# EAGLE design stromplatine (EAGLE 6.6.0)
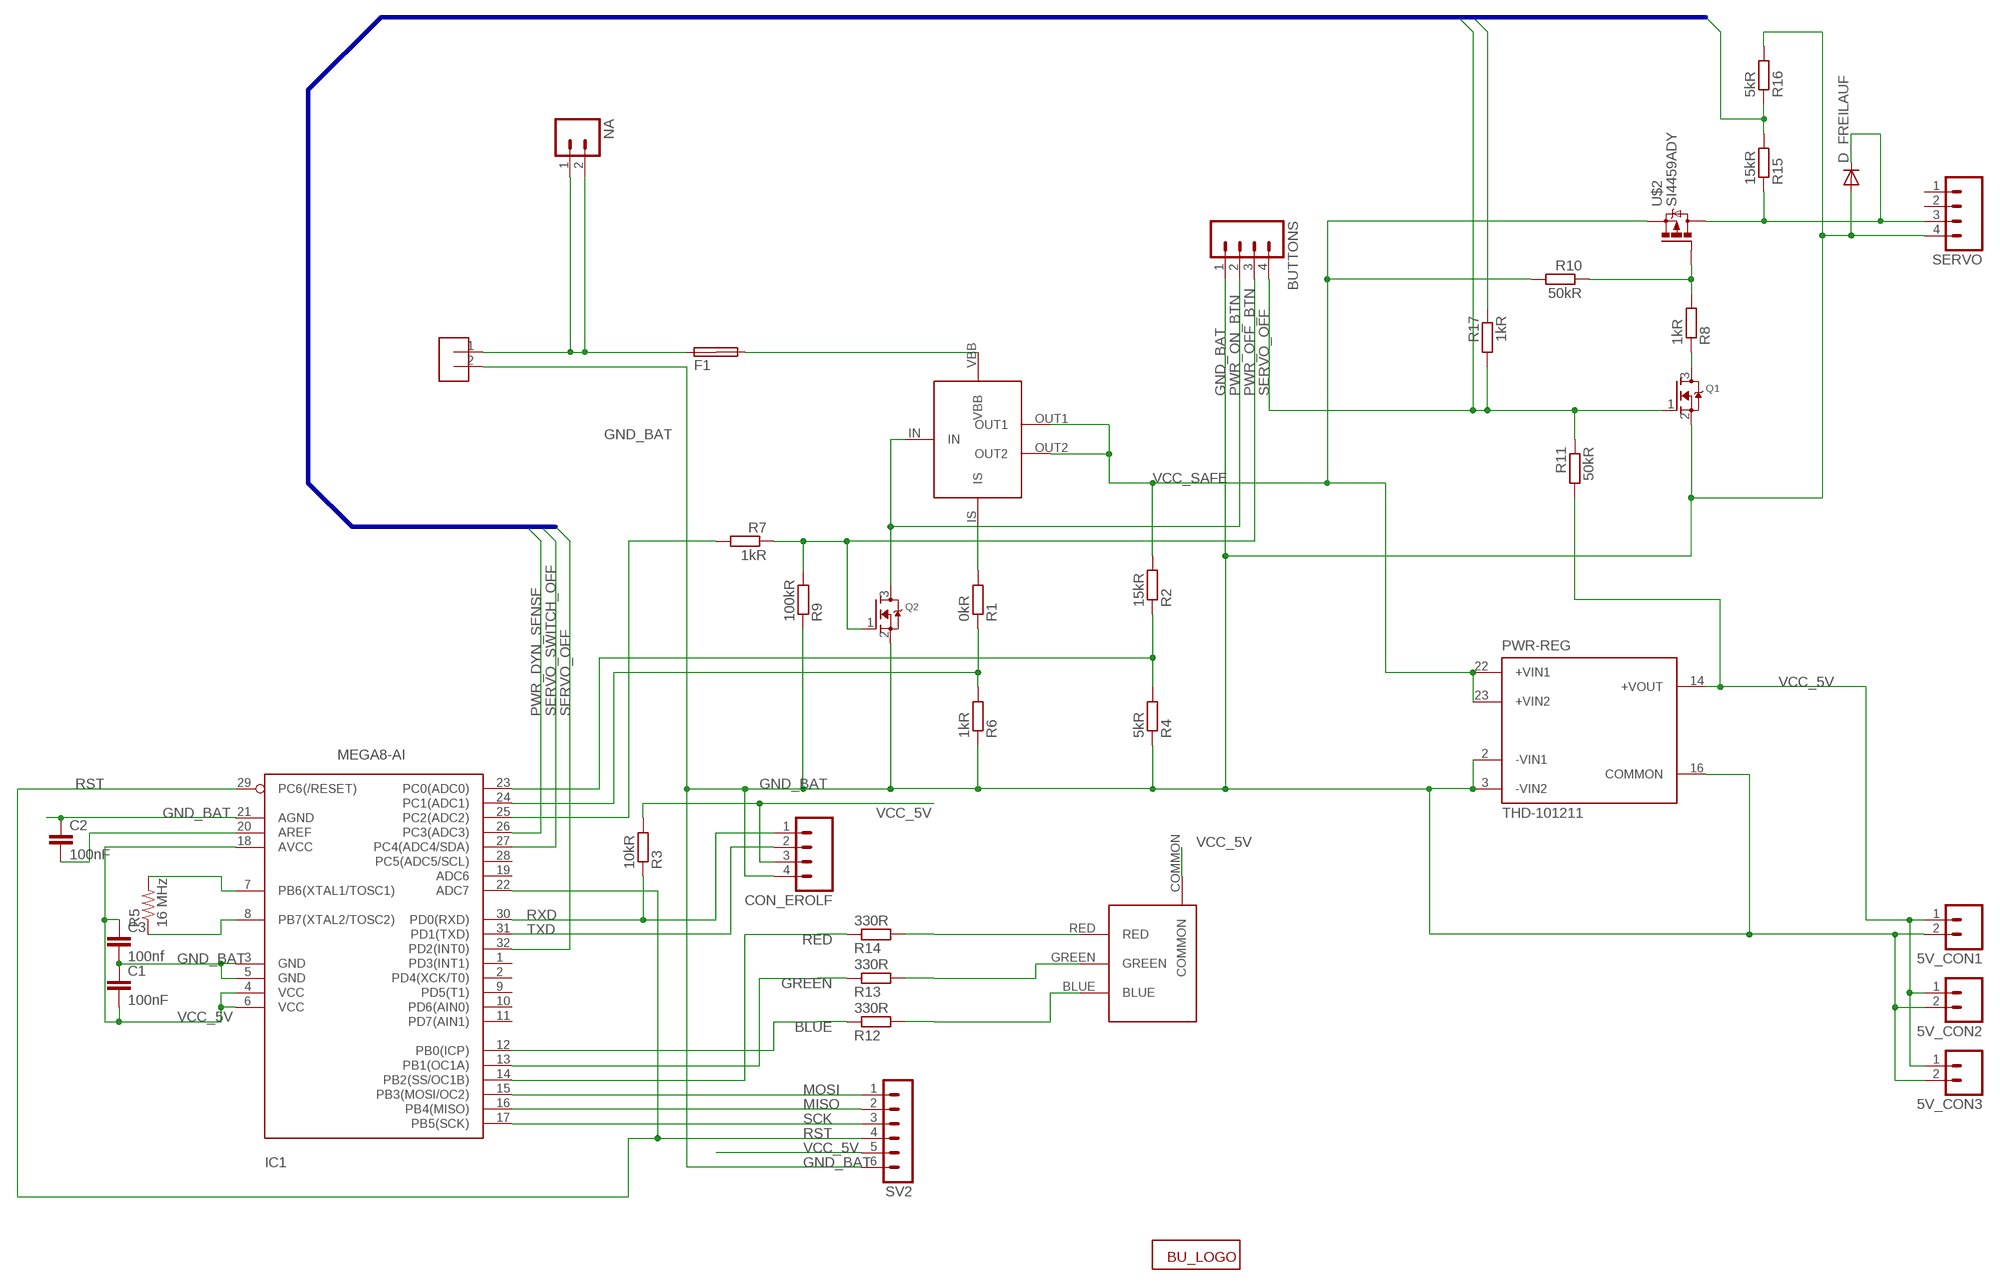
[diagram p0: schematic, sheet 1]

## Parts
5V_CON1  M02  [02P]
5V_CON2  M02  [02P]
5V_CON3  M02  [02P]
BUTTONS  M04  [04P]
C1  100nF  C-EUC0805  [C0805]
C2  100nF  C-EUC0805  [C0805]
C3  100nf  C-EUC0805  [C0805]
CON_BAT  STROMSTECKER  [STROMSTECKER]
CON_EROLF  M04  [04P]
D_FREILAUF  DIODE-DO-214AC  [DO-214AC]
F1  SHK20Q  [SHK20Q]
IC1  MEGA8-AI  [TQFP32-08]
NA  M02  [02P]
PWR-REG  THD-101211  TEN_30512  [TEN3XXXX]
Q1  MOSFET-NREFLOW  [SOT23]
Q2  MOSFET-NREFLOW  [SOT23]
R1  0kR  R-EU_M0805  [M0805]
R2  15kR  R-EU_M0805  [M0805]
R3  10kR  R-EU_M0805  [M0805]
R4  5kR  R-EU_M0805  [M0805]
R5  16 MHz  R-US_MELF0102W  [MINI_MELF-0102W]
R6  1kR  R-EU_M0805  [M0805]
R7  1kR  R-EU_M0805  [M0805]
R8  1kR  R-EU_M0805  [M0805]
R9  100kR  R-EU_M0805  [M0805]
R10  50kR  R-EU_M0805  [M0805]
R11  50kR  R-EU_M0805  [M0805]
R12  330R  R-EU_M0805  [M0805]
R13  330R  R-EU_M0805  [M0805]
R14  330R  R-EU_M0805  [M0805]
R15  15kR  R-EU_M0805  [M0805]
R16  5kR  R-EU_M0805  [M0805]
R17  1kR  R-EU_M0805  [M0805]
SERVO  M04  [04P]
SV2  MA06-1  [MA06-1]
U$1  BTS555  [PG-TO218]
U$2  SI4459ADY  [SO-8]
U$3  RGB-LED  [4-PLCC]
U$4  LOGO  [LOGO]

## Nets
BLUE: IC1.12(PB0(ICP)) R12.1
GND_BAT: 5V_CON1.2 5V_CON2.2 5V_CON3.2 BUTTONS.1 C1.1 C2.1 C3.2 CON_BAT.2 CON_EROLF.4 D_FREILAUF.A IC1.3(GND) IC1.5(GND) IC1.21(AGND) PWR-REG.2(-VIN1) PWR-REG.3(-VIN2) PWR-REG.16(COMMON) Q1.2(S) Q2.2(S) R4.1 R6.1 R9.1 R16.2 SERVO.4 SV2.6
GREEN: IC1.13(PB1(OC1A)) R13.1
MISO: IC1.16(PB4(MISO)) SV2.2
MOSI: IC1.15(PB3(MOSI/OC2)) SV2.1
N$2: F1.2A U$1.VBB
N$3: CON_BAT.1 F1.1A NA.1 NA.2
N$4: IC1.7(PB6(XTAL1/TOSC1)) R5.2
N$5: R12.2 U$3.BLUE
N$6: R13.2 U$3.GREEN
N$7: IC1.8(PB7(XTAL2/TOSC2)) R5.1
N$8: IC1.23(PC0(ADC0)) R2.1 R4.2
N$9: D_FREILAUF.C R15.1 SERVO.3 U$2.P5(D) U$2.P6(D) U$2.P7(D) U$2.P8(D)
N$10: C2.2 IC1.20(AREF)
N$11: R8.2 R10.1 U$2.P4(G)
N$12: IC1.24(PC1(ADC1)) R1.1 R6.2
N$13: R1.2 U$1.IS
N$14: Q1.3(D) R8.1
N$16: R14.2 U$3.RED
N$17: IC1.25(PC2(ADC2)) R7.2
PWR_DYN_SENSE: IC1.26(PC3(ADC3)) R15.2 R16.1
PWR_OFF_BTN: BUTTONS.3 Q2.1(G) R7.1 R9.2
PWR_ON_BTN: BUTTONS.2 Q2.3(D) U$1.IN
RED: IC1.14(PB2(SS/OC1B)) R14.1
RST: IC1.22(ADC7) IC1.29(PC6(/RESET)) SV2.4
RXD: CON_EROLF.1 IC1.30(PD0(RXD)) R3.1
SCK: IC1.17(PB5(SCK)) SV2.3
SERVO_OFF: BUTTONS.4 IC1.32(PD2(INT0)) Q1.1(G) R11.1 R17.2
SERVO_SWITCH_OFF: IC1.27(PC4(ADC4/SDA)) R17.1
TXD: CON_EROLF.2 IC1.31(PD1(TXD))
VCC_5V: 5V_CON1.1 5V_CON2.1 5V_CON3.1 C1.2 C3.1 CON_EROLF.3 IC1.4(VCC) IC1.6(VCC) IC1.18(AVCC) PWR-REG.14(+VOUT) R3.2 R11.2 SV2.5 U$3.COMMON
VCC_SAFE: PWR-REG.22(+VIN1) PWR-REG.23(+VIN2) R2.2 R10.2 U$1.OUT1 U$1.OUT2 U$2.P1(S) U$2.P2(S) U$2.P3(S)
Unconnected: F1.1B F1.2B IC1.1(PD3(INT1)) IC1.2(PD4(XCK/T0)) IC1.9(PD5(T1)) IC1.10(PD6(AIN0)) IC1.11(PD7(AIN1)) IC1.19(ADC6) IC1.28(PC5(ADC5/SCL)) SERVO.1 SERVO.2

## Buses
SERVO_SWITCH_OFF,SERVO_OFF,PWR_DYN_SWITCH_SENSR,PWR_DYN_SENSE

## Library data of the parts
5V_CON1-5V_CON3 NA = con-amp-quick:M02: AMP QUICK CONNECTOR; OC_FARNELL: unknown; OC_NEWARK: unknown
BUTTONS CON_EROLF SERVO = con-amp-quick:M04: AMP QUICK CONNECTOR; OC_FARNELL: unknown; OC_NEWARK: unknown
C1-C3 = resistor:C-EU: CAPACITOR, European symbol
CON_BAT = motorboard:STROMSTECKER
D_FREILAUF = diode:DIODE-: DIODE
F1 = fuse:SHK20Q: FUSE HOLDER 5 x 20 mm, SH contact, E1207 Buerklin 64G6061; OC_FARNELL: unknown; OC_NEWARK: unknown
IC1 = atmel:MEGA8: MICROCONTROLLER 8 Kbytes FLASH 1 kbytes SRAM 512 bytes EEPROM USART 6-channel 10 bit ADC 2-channel 8 bit ADC Source: avr.lbr
PWR-REG = traco-electronic:TEN_3*: DC/DC Konverter 3 Watt, 2 x Input, 1 x Output Source: http://www.tracopower.com/datasheet_g/ten3-d.pdf; OC_FARNELL: unknown; OC_NEWARK: unknown
Q1 Q2 = adafruit:MOSFET-N: N-Channel Mosfet 2N7002E - 60V 260mA SOT23 [Digikey: 2N7002ET1GOSTR-ND] - REEL BSH103 - 30V 850mA SOT23 [Digikey: 568-5013-1-ND]
R1-R4 R6-R17 = resistor:R-EU_: RESISTOR, European symbol
R5 = rcl:R-US_: RESISTOR, American symbol
SV2 = con-lstb:MA06-1: PIN HEADER
U$1 = bts555:BTS555
U$2 = vishay:SI4459ADY: P-Channel-MOSFET 29A 30V SO-8 http://www.digikey.com/product-detail/en/SI4459ADY-T1-GE3/SI4459ADY-T1-GE3CT-ND/1978997
U$3 = smd-rgbled:RGB-LED: rgb led http://www.digikey.com/product-detail/en/CLVBA-FKA-CAEDH8BBB7A363/CLVBA-FKA-CAEDH8BBB7A363CT-ND/2650500
U$4 = berlinunited:LOGO

## Net classes
1 supply_bat: width 1.651 mm, drill 0.508 mm, clearance 0.508 mm to class 0
2 supply_igep: width 0.508 mm, clearance 0.254 mm to class 0, clearance 0.508 mm to class 1

## Board
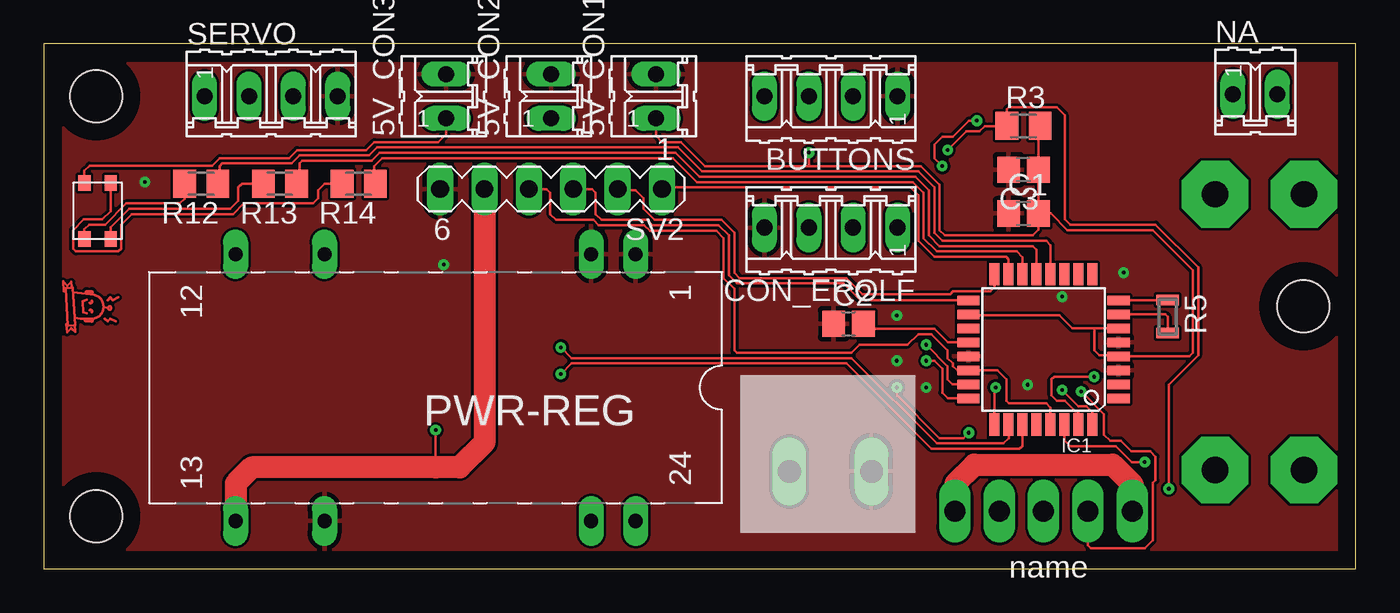
[diagram p1: board, top side]
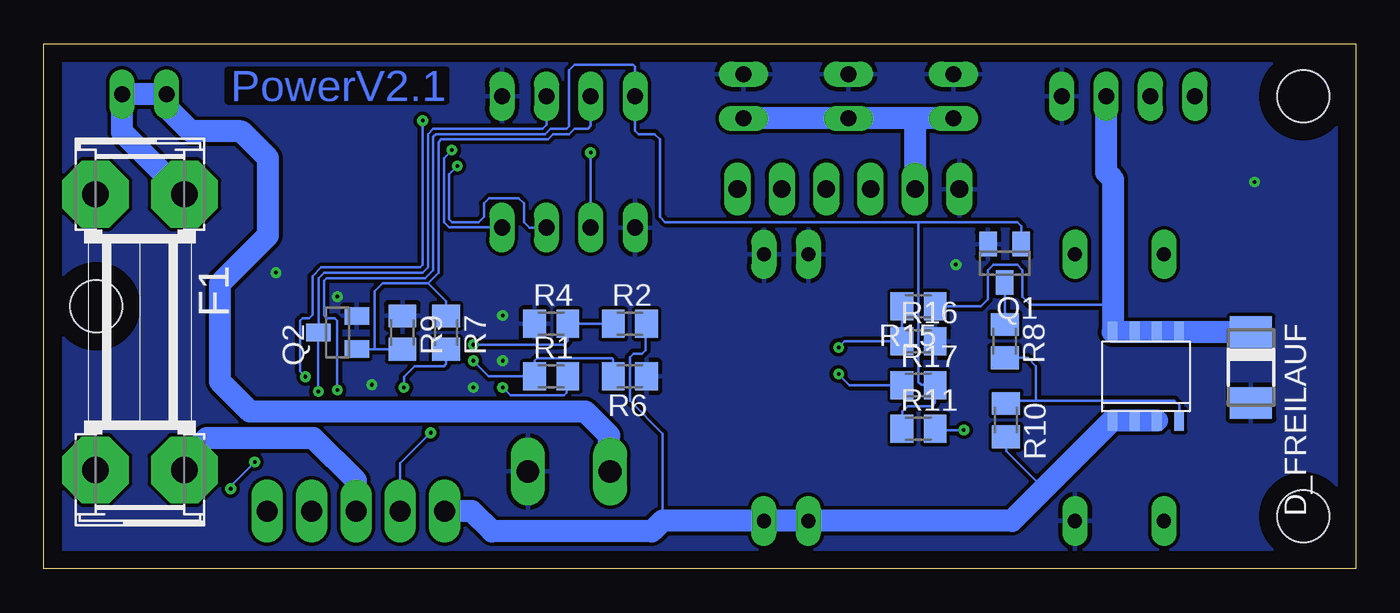
[diagram p2: board, bottom side, seen from below]

Size 75 x 30 mm. Coordinates in mm from the lower left corner, seen from the top.
Outline: 0,0 75,0 75,30 0,30 0,0
Copper layers (1*16): Top 0.035mm / dielectric 1.5mm / Bottom 0.035mm
Design rules: minimum track width 6mil, minimum drill 8mil, track to track 6mil, track to pad 6mil, pad to pad 6mil, via to via 6mil, smd to smd 6mil, copper to edge 40mil, drill to drill 8mil, minimum pad ring 10mil, minimum via ring 8mil, stop-mask expansion 4mil, vias tented up to drill 0mil, thermal gap 10mil
Holes 3 mm at 3,27 3,3 72,15

### Footprints (pad centres in the part's own frame; a part is rotated, then mirrored left to right if it is on the bottom)
02P = drill 0.914 long: 1 -1.27,0; 2 1.27,0
04P = drill 0.914 long: 1 -3.81,0; 2 -1.27,0; 3 1.27,0; 4 3.81,0
C0805 = smd 1.3 x 1.5: 1 -0.85,0; 2 0.85,0
STROMSTECKER = drill 1.3 long: 1 2.8,3.5; 2 7.5,3.5
DO-214AC = smd 1.8 x 2.4: A 2.025,0; C -2.025,0
SHK20Q = drill 1.5 pad 3.81 octagon: 1A -7.874,2.54; 1B -7.874,-2.54; 2A 7.874,2.54; 2B 7.874,-2.54
TQFP32-08 = smd 1.27 x 0.559: 1 -4.293,2.8; 2 -4.293,2; 3 -4.293,1.2; 4 -4.293,0.4; 5 -4.293,-0.4; 6 -4.293,-1.2; 7 -4.293,-2; 8 -4.293,-2.8; 17 4.293,-2.8; 18 4.293,-2; 19 4.293,-1.2; 20 4.293,-0.4; 21 4.293,0.4; 22 4.293,1.2; 23 4.293,2; 24 4.293,2.8 | smd 0.559 x 1.27: 9 -2.8,-4.293; 10 -2,-4.293; 11 -1.2,-4.293; 12 -0.4,-4.293; 13 0.4,-4.293; 14 1.2,-4.293; 15 2,-4.293; 16 2.8,-4.293; 25 2.8,4.293; 26 2,4.293; 27 1.2,4.293; 28 0.4,4.293; 29 -0.4,4.293; 30 -1.2,4.293; 31 -2,4.293; 32 -2.8,4.293
TEN3XXXX = drill 0.813 pad 1.422 long: 2 -11.43,-7.62; 3 -8.89,-7.62; 9 6.35,-7.62; 11 11.43,-7.62; 14 11.43,7.62; 16 6.35,7.62; 22 -8.89,7.62; 23 -11.43,7.62
SOT23 = smd 1 x 1.4: 1 -0.95,-1.1; 2 0.95,-1.1; 3 0,1.1
M0805 = smd 1.3 x 1.6: 1 -0.95,0; 2 0.95,0
MINI_MELF-0102W = smd 0.6 x 1.3: 1 -0.95,0; 2 0.95,0
MA06-1 = drill 1.016 long: 1 -6.35,0; 2 -3.81,0; 3 -1.27,0; 4 1.27,0; 5 3.81,0; 6 6.35,0
PG-TO218 = drill 1.2 long: IN -2.54,0; IS 2.54,0; OUT1 -5.08,0; OUT2 5.08,0; VBB 0,0
SO-8 = smd 0.559 x 1.194: P1 -1.905,-2.527; P2 -0.635,-2.527; P3 0.635,-2.527; P4 1.905,-2.527; P5 1.905,2.527; P6 0.635,2.527; P7 -0.635,2.527; P8 -1.905,2.527
4-PLCC = smd 0.9 x 0.7: BLUE 1.6,-0.75; COMMON -1.6,-0.75; GREEN 1.6,0.75; RED -1.6,0.75

### Placement (x,y rotation side)
5V_CON1  35,27 90 top
5V_CON2  29,27 90 top
5V_CON3  23,27 90 top
BUTTONS  45,27 180 top
C1  56,20.3 0 top
C2  46,14 0 top
C3  56,22.8 180 top
CON_BAT  39.82,2.06 0 top
CON_EROLF  45,19.5 180 top
D_FREILAUF  6,11.5 270 bottom
F1  69.5,13.52 270 bottom
IC1  57.15,12.53 180 top
NA  69.25,27.12 0 top
PWR-REG  22.4,10.35 180 top
Q1  20.07,17.45 180 bottom
Q2  58.2,13.5 90 bottom
R1  46,11 0 bottom
R2  41.5,14 0 bottom
R3  56,25.3 0 top
R4  46,14 0 bottom
R5  64.25,14.41 270 top
R6  41.5,11 180 bottom
R7  52,13.5 270 bottom
R8  20.07,13 270 bottom
R9  54.5,13.5 270 bottom
R10  20,8.5 270 bottom
R11  25,8 0 bottom
R12  9,22 180 top
R13  13.5,22 180 top
R14  18,22 180 top
R15  25,15 180 bottom
R16  25,13 0 bottom
R17  25,10.5 0 bottom
SERVO  13,27 0 top
SV2  29,21.7 180 top
U$1  57.16,3.29 180 top
U$2  12,11 0 bottom
U$3  3.08,20.45 270 top
U$4  2.5,15 270 top

### Tracks (layer width: path | path; a pad name or v marks a point on that pad's centre or on a via)
BLUE
  Top 0.152: R12.1 10.06,22.11 10.06,23.01 10.21,23.16 14.17,23.16 14.63,23.62 18.59,23.62 19.05,24.08 36.27,24.08 37.64,22.71 49.99,22.71 50.9,21.79 50.9,19.2 51.36,18.75 57.3,18.75 57.55,18.5 IC1.12
GND_BAT  (via drill 0.2)
  other vias: 56.24,10.52 50.44,10.36 48.77,11.89 58.22,15.54 61.72,16.92 48.77,14.48 22.86,17.37 5.79,22.1
  pour Top: 0.5,0.5 74.5,0.5 74.5,29.5 0.5,29.5
  pour Bottom (isolate 0.203): 0.5,0.5 74.5,0.5 74.5,29.5 0.5,29.5
GREEN
  Top 0.152: R13.1 14.63,22.18 14.63,23.16 14.78,23.32 18.75,23.32 19.2,23.77 36.12,23.77 37.49,22.4 49.84,22.4 50.6,21.64 50.6,19.05 51.21,18.44 56.54,18.44 56.75,18.23 IC1.13
MISO
  Top 0.152: IC1.16 54.35,16.1 54.1,15.85 51.97,15.85 51.82,15.7 46.79,15.7 45.87,16.61 39.78,16.61 39.47,16.92 39.47,19.2 38.73,19.94 34.92,19.94 34.29,20.57 34.29,21.18 33.83,21.64 32.87,21.64 SV2.2
MOSI
  Top 0.152: SV2.1 35.44,21.79 49.53,21.79 49.99,21.34 49.99,18.75 50.9,17.83 55.02,17.83 55.15,17.7 IC1.15
N$2
  Bottom 1.27: U$1.VBB 57.15,2.99 57.15,5.03 59.59,7.47 65.68,7.47 66.96,6.19 F1.2A
N$3
  Bottom 1.27: CON_BAT.1 42.67,5.61 42.67,7.62 44.04,8.99 63.22,8.99 64.92,10.69 64.92,16.31 62.18,19.05 62.18,23.47 63.7,24.99 66.6,24.99 67.98,26.37 NA.1 NA.2 70.52,24.96 F1.1A
N$4
  Top 0.152: IC1.7 64.11,14.53 64.25,14.39 R5.2
N$5
  Top 0.152: R12.2 8.05,21.16 7.77,20.88 4.72,20.88 3.5,19.66 2.59,19.66 2.33,19.4 U$3.BLUE
N$6
  Top 0.152: R13.2 11.33,22 11.12,21.79 11.12,21.03 10.67,20.57 4.88,20.57 3.83,19.53 U$3.GREEN
N$7
  Top 0.152: IC1.8 64.22,15.33 R5.1
N$8  (via drill 0.2)
  Top 0.152: v50.44,12.8 51.66,11.58 51.66,10.82 51.95,10.53 IC1.23
  Bottom 0.152: R2.1 R4.2 45.05,13.01 45.26,12.8 v50.44,12.8
N$9
  Bottom 0.152: U$2.P8 14.02,13.41 | R15.1 21.42,15 21.03,15.39 21.03,17.07 20.73,17.37 19.36,17.37 19.05,17.07 19.05,15.54 18.59,15.09 13.87,15.09
  Bottom 1.27: D_FREILAUF.C U$2.P5 U$2.P6 U$2.P7 U$2.P8 13.87,13.56 13.87,15.09 13.87,22.25 14.27,22.65 SERVO.3
N$10
  Top 0.152: C2.2 47.13,13.72 50.9,13.72 51.69,12.93 IC1.20
N$11
  Bottom 0.152: U$2.P4 10.1,9.33 10.36,9.6 18.29,9.6 | R8.2 18.76,12.05 18.29,11.58 18.29,9.6 | R10.1 19.85,9.6 18.29,9.6
N$12  (via drill 0.2)
  Top 0.152: v50.44,11.89 50.9,11.89 51.36,11.43 51.36,10.06 51.68,9.73 IC1.24
  Bottom 0.152: v50.44,11.89 49.56,11 R1.1 46.95,11.88 46.79,12.04 42.52,12.04 42.45,11.97 R6.2
N$13  (via drill 0.2)
  Top 0.152: v48.77,10.36 48.77,9.91 51.21,7.47 52.58,7.47 v52.88,7.77
  Bottom 0.152: R1.2 45.11,10.94 45.11,10.06 45.26,9.91 48.31,9.91 v48.77,10.36 | v52.88,7.77 54.62,6.04 U$1.IS
N$14
  Bottom 0.152: Q1.3 R8.1
N$16
  Top 0.152: R14.2 16.06,22 15.7,21.64 15.7,21.18 15.39,20.88 11.43,20.88 10.82,20.27 5.03,20.27 4.42,19.66 4.42,18.29 4.27,18.14 1.83,18.14 1.68,18.29 1.68,19.36 2.29,19.96 3.35,19.96 3.83,20.44 U$3.RED
N$17  (via drill 0.2)
  Top 0.152: v54.41,10.36 54.35,10.3 IC1.25
  Bottom 0.152: R7.2 52,11.7 52.12,11.58 53.8,11.58 54.41,10.97 v54.41,10.36
PWR_DYN_SENSE  (via drill 0.2)
  Top 0.152: IC1.26 55.17,8.22 55.17,7.47 54.86,7.16 51.05,7.16 46.18,12.04 30.18,12.04 v29.57,12.65
  Bottom 0.152: R15.2 R16.1 29.21,13 v29.57,12.65
PWR_OFF_BTN
  Bottom 0.152: 56.08,12.55 R9.2 | BUTTONS.3 43.73,25.31 43.89,25.15 44.65,25.15 44.96,24.84 45.87,24.84 46.18,24.54 52.27,24.54 52.43,24.38 52.43,16.92 53.03,16.31 | 53.03,16.31 55.63,16.31 56.08,15.85 56.08,12.55 | 56.08,12.55 Q2.1 | R7.1 52,15.27 53.03,16.31
PWR_ON_BTN  (via drill 0.2)
  Top 0.152: U$1.IN 59.7,1.34 59.87,1.17 62.94,1.17 63.4,1.63 63.4,4.9 63.55,5.05 63.55,6.4 63.25,6.71 62.18,6.71 61.57,7.32 60.96,7.32 60.6,7.67 60.6,8.84 v59.31,10.13
  Bottom 0.152: v59.31,10.13 Q2.3 59.3,16.59 58.98,16.92 53.34,16.92 53.03,17.22 53.03,24.84 52.73,25.15 46.48,25.15 46.27,25.36 BUTTONS.2
RED
  Top 0.152: R14.1 18.9,22.05 18.9,23.01 19.36,23.47 35.97,23.47 37.34,22.1 49.68,22.1 50.29,21.49 50.29,18.9 51.05,18.14 55.63,18.14 55.95,17.81 IC1.14
RST
  Top 0.152: SV2.4 28.74,21.7 28.96,21.49 28.96,20.27 29.29,19.94 31.42,19.94 31.73,19.63 34.31,19.63 34.65,19.3 38.46,19.3 38.86,18.9 38.86,16.61 39.47,16 39.47,12.5 39.62,12.34 46.18,12.34 46.63,12.8 49.38,12.8 49.99,13.41 50.75,13.41 51.66,12.5 51.66,12.04 51.97,11.73 51.97,11.58 52.22,11.33 IC1.22 54.5,11.33 55.02,10.82 55.02,9.6 55.17,9.45 57.3,9.45 57.55,9.2 IC1.29
RXD  (via drill 0.2)
  Top 0.152: v62.94,6.1 62.2,6.1 61.29,7.01 58.67,7.01 58.35,7.33 IC1.30 | v51.66,23.93 52.74,25 53.5,25 53.8,25.3 R3.1 55.05,26.25 55.17,26.36 57.91,26.36 58.37,25.91 58.37,19.96 58.67,19.66 63.55,19.66 65.99,17.22 65.99,12.19 64.31,10.52 v64.31,4.57
  Bottom 0.152: CON_EROLF.1 51.82,19.51 52.12,19.81 52.12,23.47 v51.66,23.93 | v64.31,4.57 64.31,4.72 v62.94,6.1
SCK
  Top 0.152: SV2.3 31.34,21.7 31.55,21.49 31.55,20.27 31.88,19.94 34.49,19.94 34.8,19.63 38.58,19.63 39.17,19.05 39.17,16.76 39.62,16.31 45.72,16.31 46.69,15.33 IC1.17
SERVO_OFF  (via drill 0.2)
  Top 0.152: v58.22,10.21 59.13,9.3 59.59,9.3 59.95,8.94 IC1.32
  Bottom 0.152: v58.22,10.21 58.22,14.17 58.37,14.33 58.83,14.33 58.98,14.48 58.98,16.46 58.83,16.61 53.19,16.61 52.73,17.07 52.73,24.69 52.58,24.84 46.33,24.84 46.02,25.15 45.11,25.15 44.96,25.3 44.96,28.5 44.65,28.8 41.3,28.8 41.19,28.69 BUTTONS.4 41.19,25.04 41,24.84 40.08,24.84 39.78,24.54 39.78,20.12 39.47,19.81 24.99,19.81 | R11.1 25.91,8.04 25.91,8.99 25.6,9.3 24.23,9.3 24.05,9.48 R17.2 24.07,10.52 24.84,10.52 24.99,10.67 24.99,19.81 | 24.99,19.81 19.36,19.81 19.12,19.57 Q1.1
SERVO_SWITCH_OFF  (via drill 0.2)
  Top 0.152: IC1.27 55.93,8.22 55.93,7.01 55.78,6.86 50.75,6.86 45.87,11.73 30.18,11.73 v29.57,11.12
  Bottom 0.152: v29.57,11.12 28.94,10.5 R17.1
TXD  (via drill 0.2)
  Top 0.152: IC1.31 59.13,8.26 59.13,8.99 58.98,8.99 58.37,9.6 57.91,9.6 57.61,9.91 57.61,10.82 57.76,10.97 v60.05,10.97 | v53.34,25.6 52.88,25.6 51.97,24.69 51.36,24.69 50.9,24.23 50.9,23.47 v51.36,23.01
  Bottom 0.152: v53.34,25.6 53.34,17.37 53.49,17.22 59.13,17.22 59.64,16.71 59.64,14.5 59.82,14.33 60.2,14.33 60.35,14.17 60.35,11.28 v60.05,10.97 | v51.36,23.01 51.82,22.55 51.82,19.96 51.66,19.81 50.14,19.81 49.84,20.12 49.84,20.88 49.53,21.18 47.85,21.18 47.55,20.88 47.55,19.81 47.24,19.5 CON_EROLF.2
VCC_5V  (via drill 0.2)
  Top 0.152: IC1.18 52.91,14.48 58.06,14.48 58.81,13.73 60.05,13.73 | 60.05,13.73 IC1.6 | 60.05,13.73 60.05,12.5 60.35,12.19 61.38,12.19 IC1.4 65.47,12.13 65.68,12.34 65.68,17.07 63.4,19.36 58.52,19.36 57.57,20.3 C1.2 | R3.2 56.85,24.9 C3.1 C1.2 | 5V_CON3.1 23,24.83 22.55,24.38 18.9,24.38 18.44,23.93 14.48,23.93 14.02,23.47 10.06,23.47 9.63,23.04 2.62,23.04 2.33,22.75 U$3.COMMON | 5V_CON1.1 35,24.74 35.36,24.38 36.42,24.38 37.8,23.01 43.74,23.01 | 43.74,23.01 50.14,23.01 51.21,21.95 51.21,19.36 51.51,19.05 56.54,19.05 56.85,19.36 C1.2 | v43.74,23.77 43.74,23.01 | v22.4,7.92 22.4,5.79
  Top 1.27: SV2.5 25.19,7.21 23.77,5.79 22.4,5.79 11.89,5.79 10.97,4.88 PWR-REG.14
  Bottom 0.152: CON_EROLF.3 43.73,23.31 v43.74,23.77 | R11.2 23.98,7.92 v22.4,7.92
  Bottom 1.27: 5V_CON1.1 5V_CON2.1 5V_CON3.1 25.19,25.73 SV2.5
VCC_SAFE
  Top 1.27: U$1.OUT2 52.12,3.03 52.12,4.88 53.19,5.94 61.11,5.94 62.23,4.82 U$1.OUT1
  Bottom 0.152: R10.2 19.96,7.51 19.96,6.71 17.82,4.56 | R2.2 40.6,13.95 40.6,12.5 40.8,12.3 41.3,12.3 41.5,12.1 41.5,9.6 39.62,7.72 39.62,2.74
  Bottom 1.27: U$2.P3 U$2.P2 U$2.P1 17.82,4.56 19.65,2.73 PWR-REG.22 PWR-REG.23 39.61,2.73 39.62,2.74 40.23,2.13 49.38,2.13 50.53,3.29 U$1.OUT2

### Text on the board
Bottom: PowerV2.1